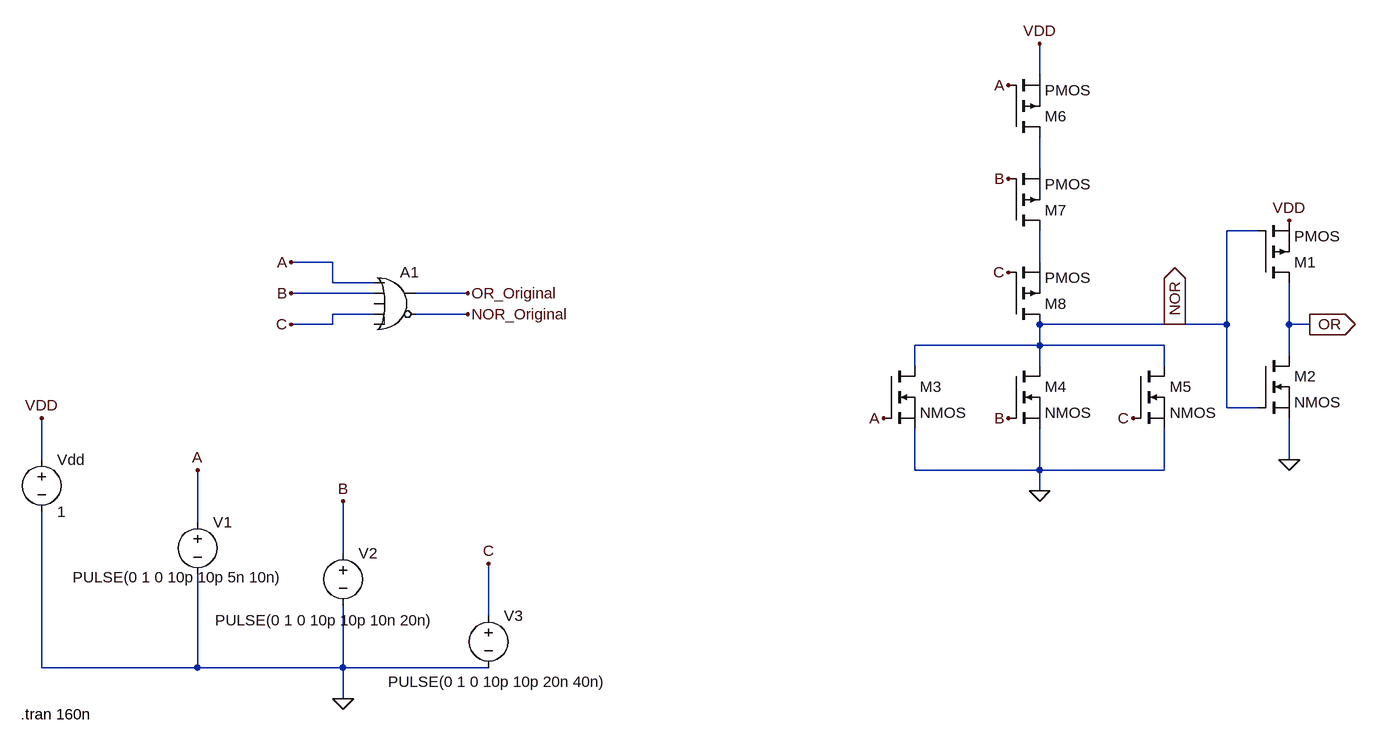
[diagram p0: schematic NOR_3ip_&_OR_3ip.asc]
NOR_3ip_&_OR_3ip.asc, the LTspice schematic file:
Version 4
SHEET 1 3108 680
WIRE 1680 -480 1680 -528
WIRE 1680 -336 1680 -384
WIRE 2016 -240 1968 -240
WIRE 592 -192 528 -192
WIRE 1680 -192 1680 -240
WIRE 592 -160 592 -192
WIRE 656 -160 592 -160
WIRE 656 -144 528 -144
WIRE 800 -144 720 -144
WIRE 656 -112 592 -112
WIRE 800 -112 720 -112
WIRE 592 -96 592 -112
WIRE 592 -96 528 -96
WIRE 1888 -96 1680 -96
WIRE 1968 -96 1968 -240
WIRE 1968 -96 1888 -96
WIRE 2064 -96 2064 -160
WIRE 2096 -96 2064 -96
WIRE 1680 -64 1680 -96
WIRE 1680 -64 1488 -64
WIRE 1872 -64 1680 -64
WIRE 2064 -48 2064 -96
WIRE 1488 -32 1488 -64
WIRE 1680 -32 1680 -64
WIRE 1872 -32 1872 -64
WIRE 1968 32 1968 -96
WIRE 2016 32 1968 32
WIRE 144 112 144 48
WIRE 2064 112 2064 48
WIRE 1488 128 1488 64
WIRE 1680 128 1680 64
WIRE 1680 128 1488 128
WIRE 1872 128 1872 64
WIRE 1872 128 1680 128
WIRE 1680 160 1680 128
WIRE 384 208 384 128
WIRE 608 256 608 176
WIRE 832 352 832 272
WIRE 144 432 144 192
WIRE 384 432 384 288
WIRE 384 432 144 432
WIRE 608 432 608 336
WIRE 608 432 384 432
WIRE 832 432 608 432
WIRE 608 480 608 432
FLAG 608 480 0
FLAG 384 128 A
FLAG 144 48 VDD
FLAG 608 176 B
FLAG 800 -144 OR_Original
FLAG 800 -112 NOR_Original
FLAG 832 272 C
FLAG 528 -192 A
FLAG 528 -144 B
FLAG 528 -96 C
FLAG 1680 160 0
FLAG 1440 48 A
FLAG 1632 48 B
FLAG 1824 48 C
FLAG 2064 -256 VDD
FLAG 2064 112 0
FLAG 1888 -96 NOR
IOPIN 1888 -96 Out
FLAG 2096 -96 OR
IOPIN 2096 -96 Out
FLAG 1632 -464 A
FLAG 1632 -320 B
FLAG 1632 -176 C
FLAG 1680 -528 VDD
SYMBOL voltage 144 96 R0
WINDOW 123 0 0 Left 0
WINDOW 39 0 0 Left 0
SYMATTR InstName Vdd
SYMATTR Value 1
SYMBOL voltage 384 192 R0
WINDOW 123 0 0 Left 0
WINDOW 39 0 0 Left 0
WINDOW 3 -192 101 Left 2
SYMATTR Value PULSE(0 1 0 10p 10p 5n 10n)
SYMATTR InstName V1
SYMBOL voltage 608 240 R0
WINDOW 123 0 0 Left 0
WINDOW 39 0 0 Left 0
WINDOW 3 -197 119 Left 2
SYMATTR Value PULSE(0 1 0 10p 10p 10n 20n)
SYMATTR InstName V2
SYMBOL voltage 832 336 R0
WINDOW 123 0 0 Left 0
WINDOW 39 0 0 Left 0
WINDOW 3 -155 118 Left 2
SYMATTR Value PULSE(0 1 0 10p 10p 20n 40n)
SYMATTR InstName V3
SYMBOL pmos 2016 -160 M180
SYMATTR InstName M1
SYMBOL nmos 2016 -48 R0
SYMATTR InstName M2
SYMBOL nmos 1440 -32 R0
SYMATTR InstName M3
SYMBOL nmos 1632 -32 R0
SYMATTR InstName M4
SYMBOL nmos 1824 -32 R0
SYMATTR InstName M5
SYMBOL pmos 1632 -384 M180
SYMATTR InstName M6
SYMBOL pmos 1632 -240 M180
SYMATTR InstName M7
SYMBOL pmos 1632 -96 M180
SYMATTR InstName M8
SYMBOL Digital\\or 688 -192 R0
SYMATTR InstName A1
TEXT 112 504 Left 2 !.tran 160n

The netlist it stands for:
* NOR_3ip_&_OR_3ip.asc
Vdd VDD 0 1
V1 A 0 PULSE(0 1 0 10p 10p 5n 10n)
V2 B 0 PULSE(0 1 0 10p 10p 10n 20n)
V3 C 0 PULSE(0 1 0 10p 10p 20n 40n)
M1 OR NOR VDD VDD PMOS
M2 OR NOR 0 0 NMOS
M3 NOR A 0 0 NMOS
M4 NOR B 0 0 NMOS
M5 NOR C 0 0 NMOS
M6 N001 A VDD VDD PMOS
M7 N002 B N001 N001 PMOS
M8 NOR C N002 N002 PMOS
A1 A B 0 C 0 NOR_Original OR_Original 0 OR
.model NMOS NMOS
.model PMOS PMOS
.lib standard.mos
.tran 160n
.backanno
.end